# EAGLE design 2LD-17-mk-1.2.0 (EAGLE 7.5.0)
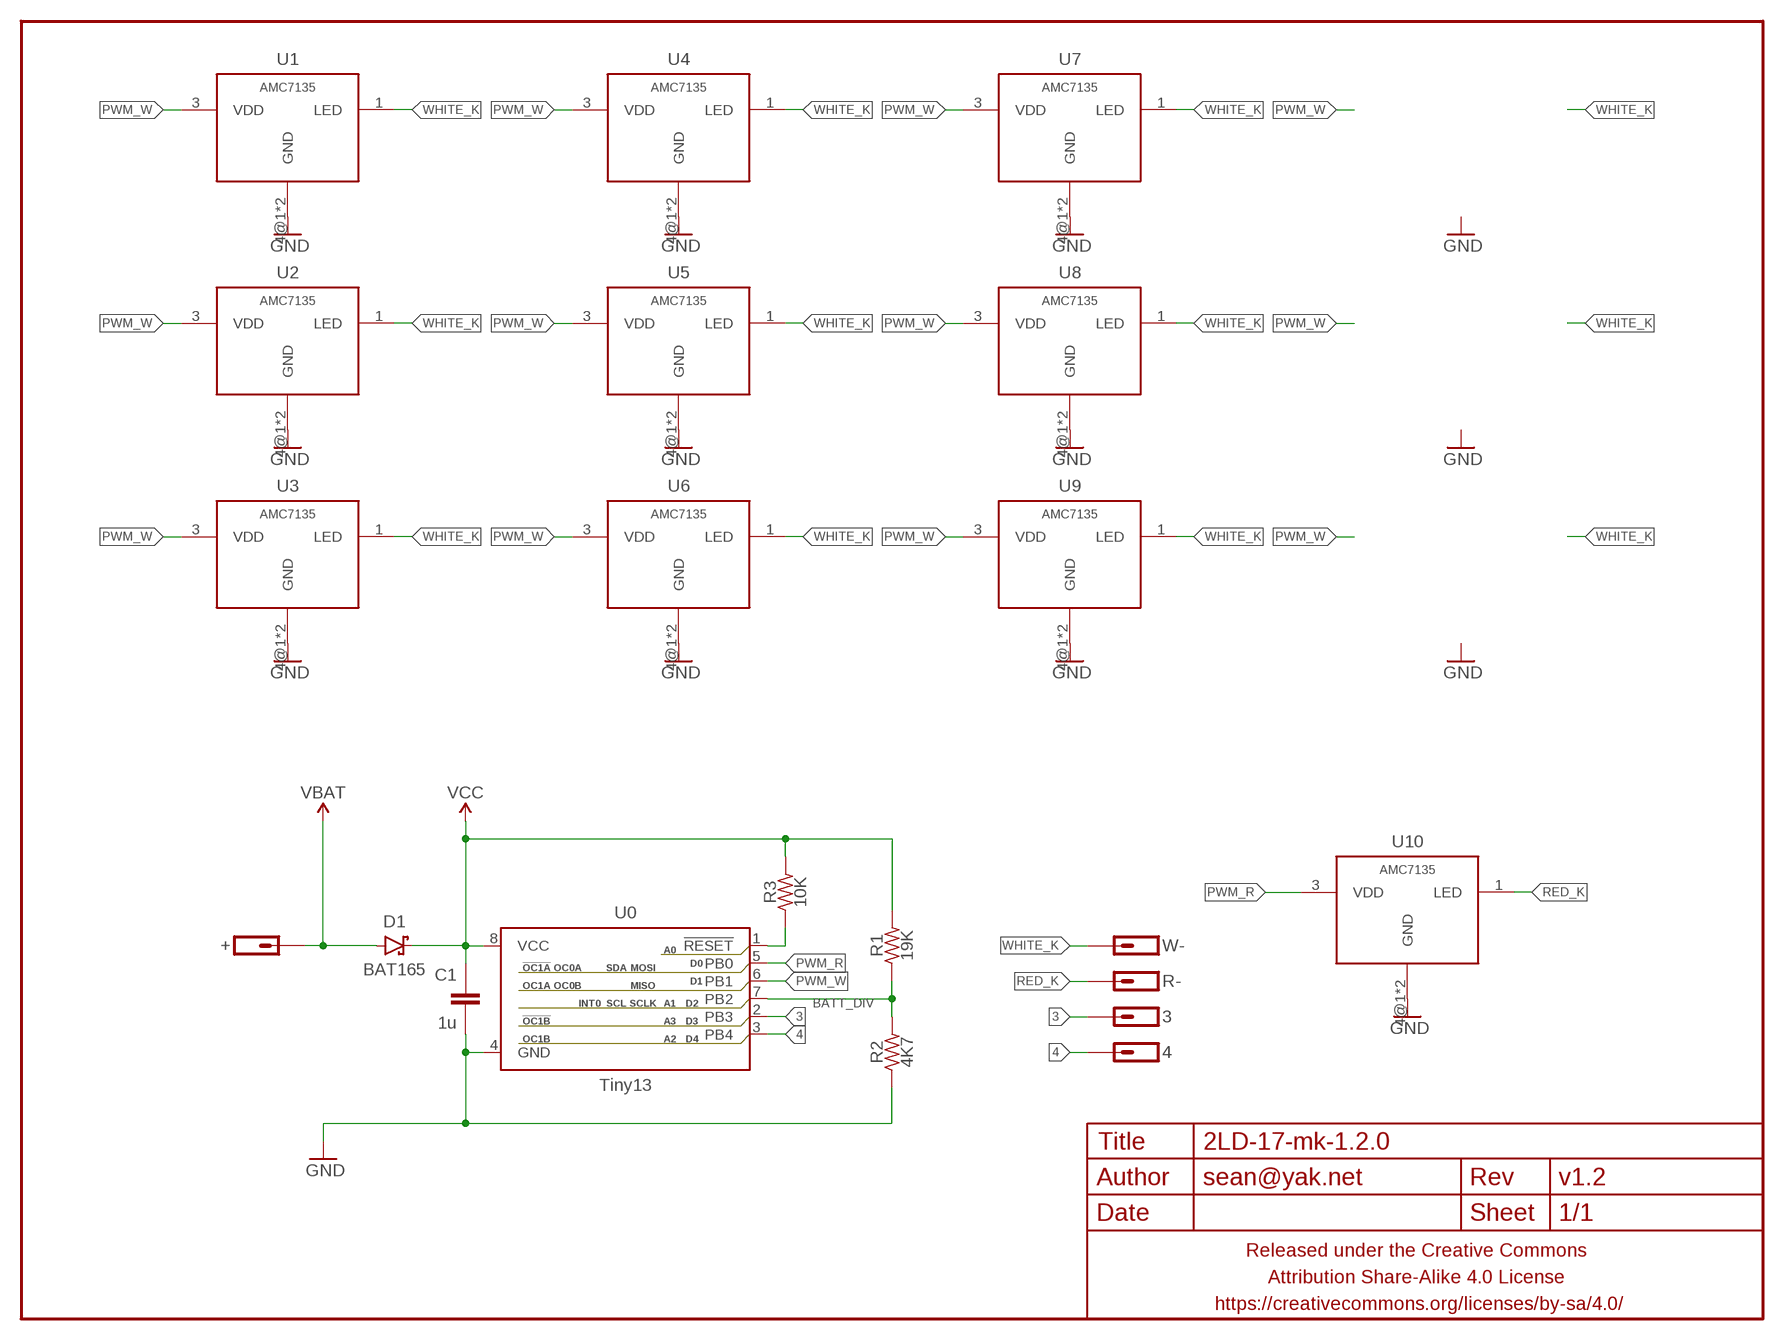
[diagram p0: schematic, sheet 1]

## Parts
3  M01SMD-1MM-DIA-NS  [1X01-SMD-1MM-DIA-NS]
4  M01SMD-1MM-DIA-NS  [1X01-SMD-1MM-DIA-NS]
+  M01PTH-1.2MM-NS  [1X01-1.2MM-NS]
C1  1u  CAPACITOR-CERAMICC0603-TIGHTER  [C0603-TIGHTER]
D1  BAT165  DIODE-SCHOTTKYSOD123  [SOD123-SCHOTTKY]
FRAME1  FRAME-LETTERNO_PACKAGE  [DUMMY]
R1  19K  RESISTORR0603-TIGHTER  [R0603-TIGHTER]
R2  4K7  RESISTORR0603-TIGHTER  [R0603-TIGHTER]
R3  10K  RESISTORR0603-TIGHTER  [R0603-TIGHTER]
R-  M01SMD-1.25MM-DIA  [1X01-SMD-1.25MM-DIA-NS]
U0  Tiny13  ATTINY13SOIC-NARROWPADS  [SO08-NARROWER]
U1  AMC7135  AMC7135SOT-89-NOTHERM-ROUNDED  [SOT89-NOTHERM-ROUNDED]
U2  AMC7135  AMC7135SOT-89-NOTHERM-ROUNDED  [SOT89-NOTHERM-ROUNDED]
U3  AMC7135  AMC7135SOT-89-NOTHERM-ROUNDED  [SOT89-NOTHERM-ROUNDED]
U4  AMC7135  AMC7135SOT-89-NOTHERM-ROUNDED  [SOT89-NOTHERM-ROUNDED]
U5  AMC7135  AMC7135SOT-89-NOTHERM-ROUNDED  [SOT89-NOTHERM-ROUNDED]
U6  AMC7135  AMC7135SOT-89-NOTHERM-ROUNDED  [SOT89-NOTHERM-ROUNDED]
U7  AMC7135  AMC7135SOT-89-NOTHERM-ROUNDED  [SOT89-NOTHERM-ROUNDED]
U8  AMC7135  AMC7135SOT-89-NOTHERM-ROUNDED  [SOT89-NOTHERM-ROUNDED]
U9  AMC7135  AMC7135SOT-89-NOTHERM-ROUNDED  [SOT89-NOTHERM-ROUNDED]
U10  AMC7135  AMC7135SOT-89-NOTHERM-ROUNDED  [SOT89-NOTHERM-ROUNDED]
W-  M01SMD-1.5MM-DIA-NS  [1X01-SMD-1.5MM-DIA-NS]

## Nets
3: 3.P$1 U0.2(PB3)
4: 4.P$1 U0.3(PB4)
BATT_DIV: R1.1 R2.2 U0.7(PB2)
GND: C1.2 R2.1 U0.4(GND) U1.4@1(GND) U1.4@2(GND) U2.4@1(GND) U2.4@2(GND) U3.4@1(GND) U3.4@2(GND) U4.4@1(GND) U4.4@2(GND) U5.4@1(GND) U5.4@2(GND) U6.4@1(GND) U6.4@2(GND) U7.4@1(GND) U7.4@2(GND) U8.4@1(GND) U8.4@2(GND) U9.4@1(GND) U9.4@2(GND) U10.4@1(GND) U10.4@2(GND)
N$1: R3.1 U0.1(!RESET)
PWM_R: U0.5(PB0) U10.3(VDD)
PWM_W: U0.6(PB1) U1.3(VDD) U2.3(VDD) U3.3(VDD) U4.3(VDD) U5.3(VDD) U6.3(VDD) U7.3(VDD) U8.3(VDD) U9.3(VDD)
RED_K: R-.P$1 U10.1(LED)
VBAT: +.P$1 D1.A
VCC: C1.1 D1.C R1.2 R3.2 U0.8(VCC)
WHITE_K: U1.1(LED) U2.1(LED) U3.1(LED) U4.1(LED) U5.1(LED) U6.1(LED) U7.1(LED) U8.1(LED) U9.1(LED) W-.P$1

## Library data of the parts
3 4 + R- W- = a_parts:M01: Header 1 Standard 1-pin 0.1" header. Use with straight break away headers (SKU : PRT-00116), right angle break away headers (PRT-00553), swiss pins (PRT-00743), machine pins (PRT-00117), and female headers (PRT-00115).
C1 = a_parts:CAPACITOR-CERAMIC: CAPACITOR, European symbol
D1 = a_parts:DIODE-SCHOTTKY: Schottky diodes in SFE's production catalog BAT20J 1A 23V 0.62Vf RB751 120mA 40V 0.37Vf PMEG4005EJ 0.5A 40V 0.42Vf MBRA140 1A 40V 0.5Vf B340A 3A 40V SMA
FRAME1 = a_parts:FRAME-LETTER: Schematic Frame Standard 8.5x11 US Letter frame; DESIGNER: sean@yak.net; VERSION: v1.2
R1-R3 = a_parts:RESISTOR: RESISTOR, American symbol
U0 = a_parts:ATTINY13: Atmel 8-pin 1kB flash uC
U1-U10 = a_parts:AMC7135

## Board
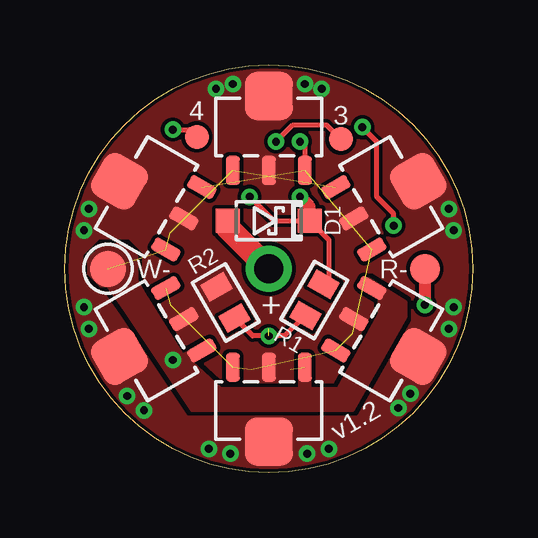
[diagram p1: board, top side]
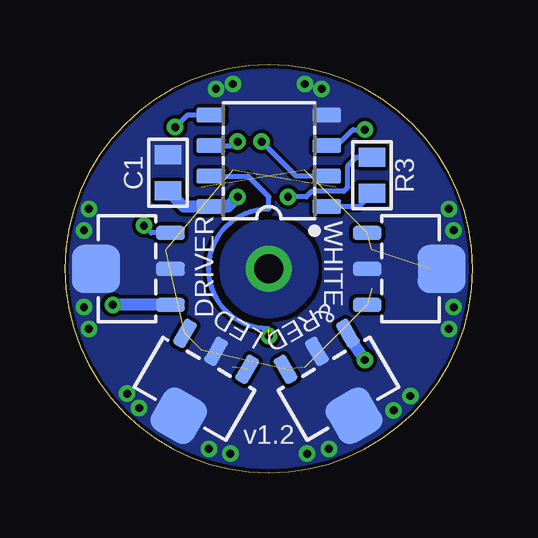
[diagram p2: board, bottom side, seen from below]

Size 17 x 17 mm. Coordinates in mm from the lower left corner, seen from the top.
Outline: 0,8.5 arc-180 17,8.5 arc-180 0,8.5
Copper layers (1*16): Top 0.0356mm / dielectric 1.5011mm / Bottom 0.0356mm
Design rules "LaenPCBOrder2": minimum track width 6mil, minimum drill 13mil, track to track 6mil, track to pad 6mil, pad to pad 6mil, via to via 6mil, smd to smd 6mil, copper to edge 6mil, drill to drill 6mil, minimum pad ring 7mil, minimum via ring 7mil, stop-mask expansion 3mil, vias tented up to drill 20mil, thermal gap 10mil

### Footprints (pad centres in the part's own frame; a part is rotated, then mirrored left to right if it is on the bottom)
1X01-SMD-1MM-DIA-NS = smd 1 x 1: P$1 0,0
1X01-1.2MM-NS = drill 1.2 pad 1.93: P$1 0,0
C0603-TIGHTER = smd 0.8 x 1.1: 1 -0.75,0; 2 0.75,0
SOD123-SCHOTTKY = smd 1 x 1: A -1.7,0; C 1.7,0
R0603-TIGHTER = smd 0.8 x 1.1: 1 -0.75,0; 2 0.75,0
1X01-SMD-1.25MM-DIA-NS = smd 1.25 x 1.25: P$1 0,0
SO08-NARROWER = smd 0.6 x 1.2: 1 -1.905,-2.416; 2 -0.635,-2.416; 3 0.635,-2.416; 4 1.905,-2.416; 5 1.905,2.416; 6 0.635,2.416; 7 -0.635,2.416; 8 -1.905,2.416
SOT89-NOTHERM-ROUNDED = smd 0.58 x 1.2: 1 -1.5,-1.8; 3 1.5,-1.8; 4@1 0,-1.8 | smd 2 x 2: 4@2 0,1.3
1X01-SMD-1.5MM-DIA-NS = smd 1.5 x 1.5: P$1 0,0

### Placement (x,y rotation side)
3  11.5,13.9 0 top
4  5.5,14 180 top
+  8.5,8.5 90 top
C1  12.7,12.5 90 bottom
D1  8.5,10.5 0 top
FRAME1  0,0 0 top
R1  10.4,7.2 60 top
R2  6.7,7.1 300 top
R3  4.2,12.4 90 bottom
R-  15,8.5 0 top
U0  8.5,13 90 bottom
U1  8.5,14.4 0 top
U2  13.6,11.5 300 top
U3  13.6,5.5 240 top
U4  8.5,2.6 180 top
U5  3.4,5.5 120 top
U6  3.4,11.5 60 top
U7  11.6,3.5 150 bottom
U8  5.6,3.5 210 bottom
U9  2.6,8.5 270 bottom
U10  14.4,8.5 90 bottom
W-  1.8,8.5 270 top

### Tracks (layer width: path | path; a pad name or v marks a point on that pad's centre or on a via)
3  (via drill 0.33)
  Top 0.2: v8.8,13.8 9.5,14.5 10.9,14.5 3.P$1
  Bottom 0.2: U0.2 7.37,12.37 v8.8,13.8
4  (via drill 0.33)
  Top 0.2: v4.5,14.3 5.2,14.3 4.P$1
  Bottom 0.2: U0.3 5.67,13.63 5,14.3 v4.5,14.3
BATT_DIV  (via drill 0.33)  (1 unrouted)
  Top 0.2: R2.2 7.83,5.7 v8.5,5.7 9.18,5.7 R1.1
  Bottom 0.2: 8.5,6 arc180 8.5,11 8.5,11.5 9.37,12.37 U0.7
GND  (via drill 0.33)
  other vias: 0.8,6.9 2.6,3.2 3.3,2.6 1,6 6,1 6.9,0.8 10.1,0.8 11,1 13.9,2.7 14.4,3.3 16,6 16.2,6.9 16.2,10.1 16,11 0.8,10.1 1,11 7,16.2 10,16.2 6.3,16 10.7,16
  pour Top (isolate 0.152, rank 6, no thermals): 0,8.5 arc90 8.5,0 arc90 17,8.5 arc90 8.5,17 arc90
  pour Bottom (isolate 0.152, rank 6, no thermals): 17,8.5 arc-90 8.5,0 arc-90 0,8.5 arc-90 8.5,17 arc-90
N$1
  Bottom 0.2: R3.1 4.75,11.1 U0.1
PWM_R  (via drill 0.33)
  Top 0.2: v12.4,14.4 13,13.8 13,11.5 13.7,10.8 v13.7,10.3
  Bottom 0.2: U0.5 11.89,14.9 v12.4,14.4 | U10.3 13.4,10 v13.7,10.3
PWM_W  (via drill 0.33)  (8 unrouted)
  Top 0.2: v9.8,13.8 10,13.6 U1.3
  Bottom 0.2: U0.6 9.96,13.63 v9.8,13.8
RED_K  (via drill 0.33)
  Top 0.5: R-.P$1 v15,7
  Bottom 0.5: U10.1 v15,7
VBAT
  Top 1: +.P$1 6.8,10.2 D1.A
  pour Bottom (isolate 0.152, no thermals): 6.5,8.5 arc-180 10.5,8.5 arc-180
VCC  (via drill 0.33)
  Top 0.2: R1.2 11,8.07 11,9.7 D1.C 8.7,10.5 v7.7,11.5
  Top 0.5: D1.C 10.2,11.1 v9.8,11.5
  Bottom 0.2: R3.2 4.85,13.15 5.2,12.8 5.2,11.9 5.37,11.73 6.7,11.73 6.93,11.5 v7.7,11.5
  Bottom 0.5: v9.8,11.5 10.21,11.1 U0.8 12.04,11.1 C1.1
WHITE_K  (via drill 0.33)  (5 unrouted)
  Bottom 0.5: U8.1 5.2,5.7 v4.5,4.7
  pour Top (isolate 0.152, rank 2, no thermals): 12.6,8.1 14.2,7.1 14.2,6.5 12,2.6 5.3,2.6 2.5,6.8 1.8,7.8 1.5,7.8 1,8.3 1,8.9 1.6,9.5 2.5,9.5 3,9 3,8 3.4,7.3 4.9,4.9 5.1,5 6,5.5 6.2,5.1 5.3,4.6 6.5,3.5 9.8,3.5 9.8,4.6 10.2,4.6 10.2,3.5 11.4,3.5 13.1,6.6 13.1,7.3 12.4,7.7

### Text on the board
bPlace: WHITE | DRIVER | & | RED | LED